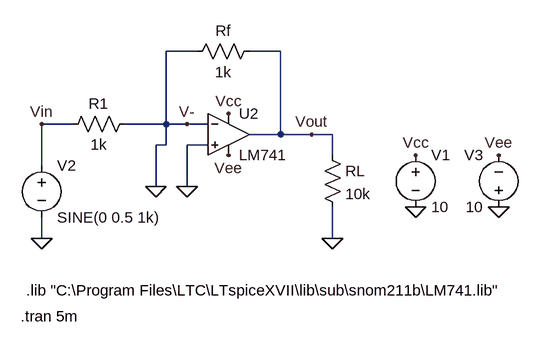
[diagram p0: schematic LM741-inverting.asc]
LM741-inverting.asc, the LTspice schematic file:
Version 4
SHEET 1 880 680
WIRE 160 64 112 64
WIRE 288 64 240 64
WIRE -32 176 -80 176
WIRE 112 176 112 64
WIRE 112 176 48 176
WIRE 144 176 112 176
WIRE 176 176 144 176
WIRE 288 192 288 64
WIRE 288 192 240 192
WIRE 336 192 288 192
WIRE 368 192 336 192
WIRE 112 208 112 176
WIRE 112 208 96 208
WIRE 176 208 144 208
WIRE 368 224 368 192
WIRE -80 240 -80 176
WIRE 96 272 96 208
WIRE 144 272 144 208
WIRE -80 352 -80 320
WIRE 368 352 368 304
FLAG 144 272 0
FLAG 496 304 0
FLAG 624 304 0
FLAG 368 352 0
FLAG 496 224 Vcc
FLAG 624 224 Vee
FLAG 208 160 Vcc
FLAG 208 224 Vee
FLAG 336 192 Vout
FLAG -80 352 0
FLAG -80 176 Vin
FLAG 144 176 V-
FLAG 96 272 0
SYMBOL voltage 496 208 R0
WINDOW 123 0 0 Left 0
WINDOW 39 0 0 Left 0
SYMATTR InstName V1
SYMATTR Value 10
SYMBOL voltage 624 320 R180
WINDOW 0 24 96 Left 2
WINDOW 3 24 16 Left 2
WINDOW 123 0 0 Left 0
WINDOW 39 0 0 Left 0
SYMATTR InstName V3
SYMATTR Value 10
SYMBOL res 352 208 R0
SYMATTR InstName RL
SYMATTR Value 10k
SYMBOL OpAmps\\opamp2 208 128 R0
SYMATTR InstName U2
SYMATTR Value LM741
SYMBOL res 256 48 R90
WINDOW 0 0 56 VBottom 2
WINDOW 3 32 56 VTop 2
SYMATTR InstName Rf
SYMATTR Value 1k
SYMBOL voltage -80 224 R0
WINDOW 123 0 0 Left 0
WINDOW 39 0 0 Left 0
SYMATTR InstName V2
SYMATTR Value SINE(0 0.5 1k)
SYMBOL res 64 160 R90
WINDOW 0 0 56 VBottom 2
WINDOW 3 32 56 VTop 2
SYMATTR InstName R1
SYMATTR Value 1k
TEXT -112 472 Left 2 !.tran 5m
TEXT -104 432 Left 2 !.lib "C:\\Program Files\\LTC\\LTspiceXVII\\lib\\sub\\snom211b\\LM741.lib"

The netlist it stands for:
* LM741-inverting.asc
V1 Vcc 0 10
V3 0 Vee 10
RL Vout 0 10k
XU2 0 0 Vcc Vee Vout LM741  ; pins In+ In- V+ V- OUT
Rf Vout 0 1k
V2 Vin 0 SINE(0 0.5 1k)
R1 0 Vin 1k
.tran 5m
.lib "C:\Program Files\LTC\LTspiceXVII\lib\sub\snom211b\LM741.lib"
.backanno
.end